# EAGLE design v1.3 (EAGLE 6.0)
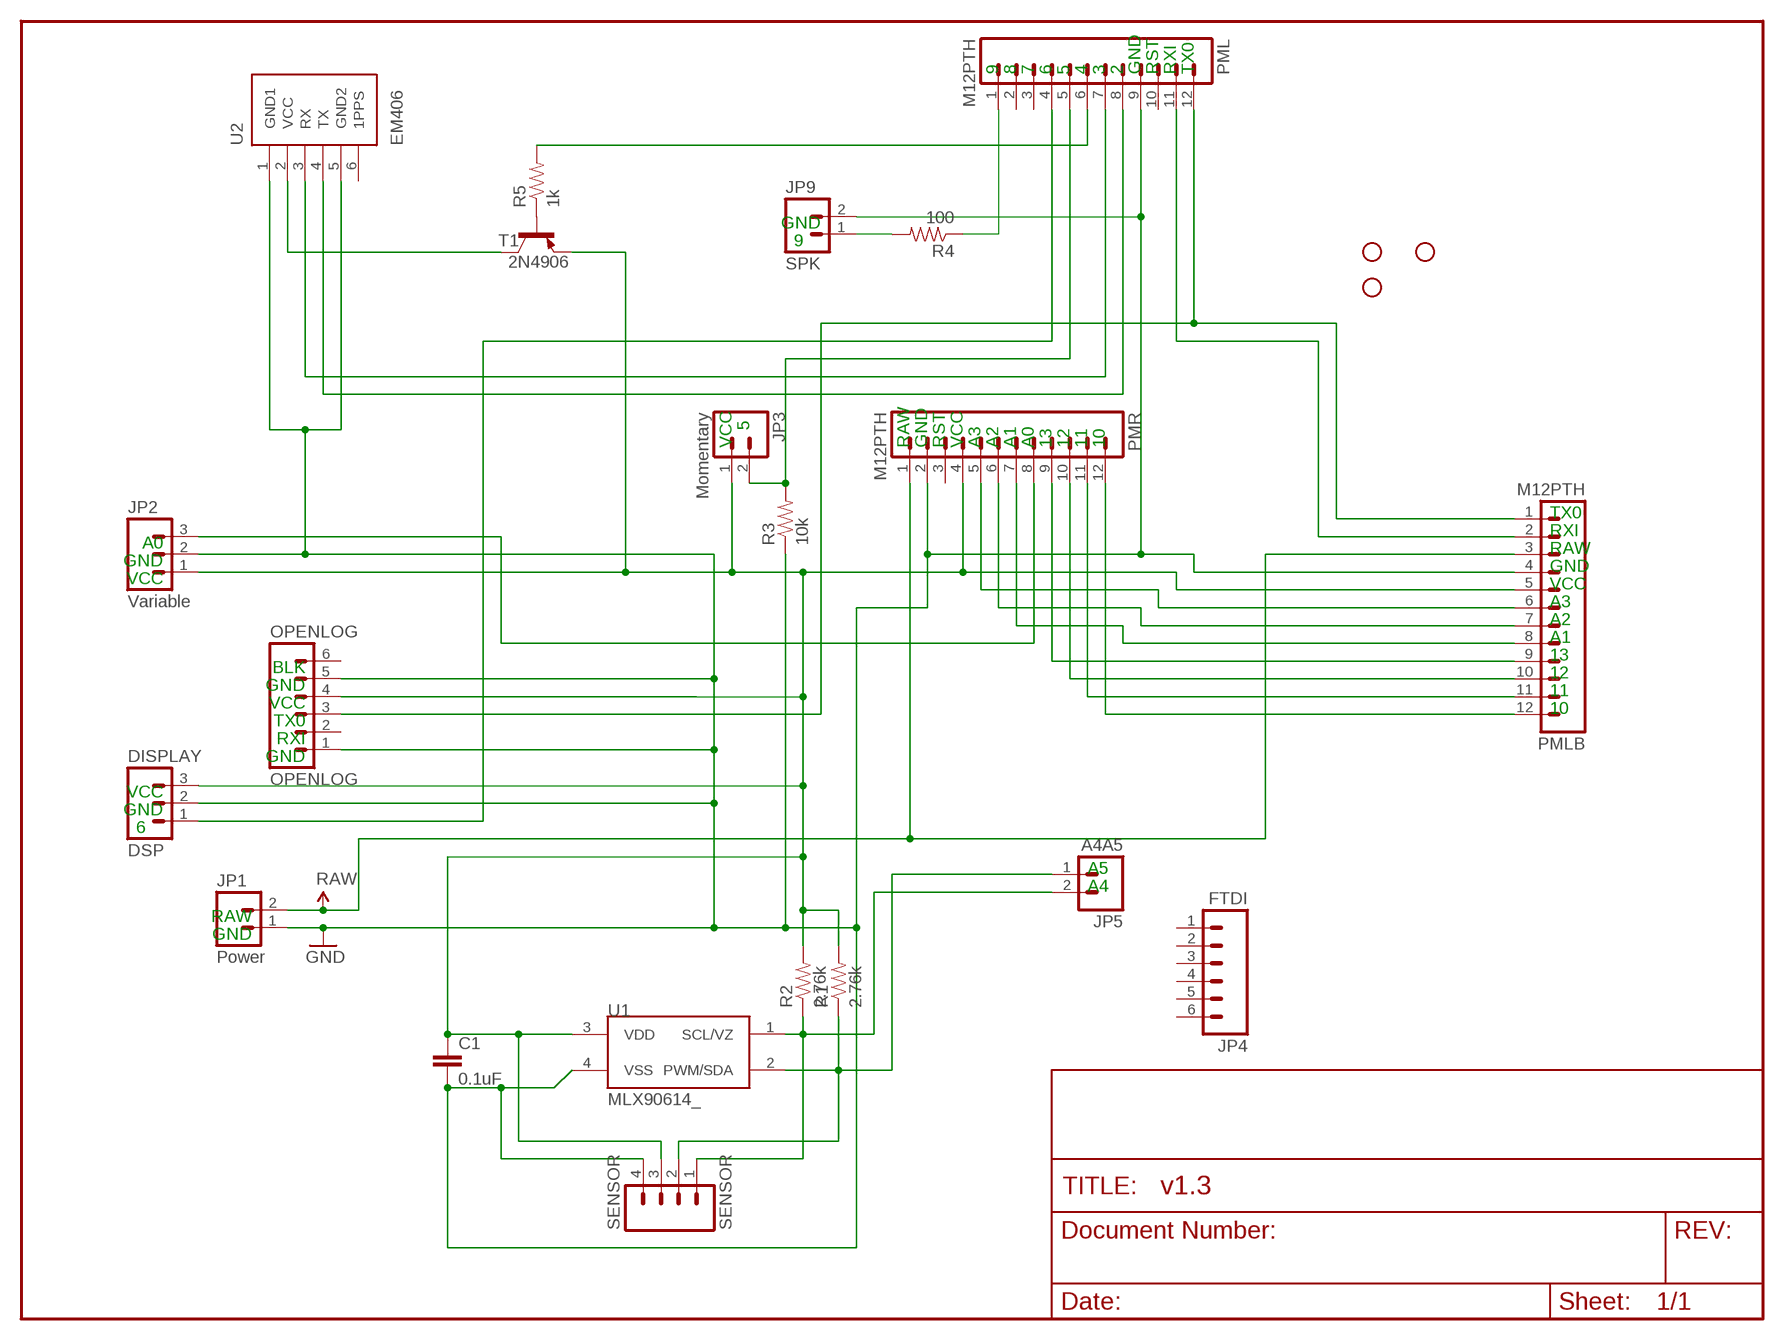
[diagram p0: schematic, sheet 1]

## Parts
2N4906  T1  2N3906-PNP-TO92-EBC  [TO92-EBC]
C1  0.1uF  CAPPTH3  [CAP-PTH-LARGE]
DISPLAY  DSP  M03SCREW_LOCK  [SCREWTERMINAL-3.5MM-3_LOCK.007S]
JP1  Power  M02JST-PTH-2  [JST-2-PTH]
JP2  Variable  M03SCREW_LOCK  [SCREWTERMINAL-3.5MM-3_LOCK.007S]
JP3  Momentary  M02JST-PTH-2  [JST-2-PTH]
JP4  FTDI  M06SIP  [1X06]
JP5  A4A5  M02PTH  [1X02]
JP6  STAND-OFFTIGHT  [STAND-OFF-TIGHT]
JP7  STAND-OFFTIGHT  [STAND-OFF-TIGHT]
JP8  STAND-OFFTIGHT  [STAND-OFF-TIGHT]
JP9  SPK  M023.5MM  [SCREWTERMINAL-3.5MM-2]
OPENLOG  OPENLOG  M06LOCK  [1X06_LOCK]
PML  M12PTH  [1X12]
PMLB  M12PTH  [1X12]
PMR  M12PTH  [1X12]
R1  2.76k  RESISTORPTH-1/4W  [AXIAL-0.4]
R2  2.76k  RESISTORPTH-1/4W  [AXIAL-0.4]
R3  10k  RESISTORPTH-1/4W  [AXIAL-0.4]
R4  100  RESISTORPTH-1/4W  [AXIAL-0.4]
R5  1k  RESISTORPTH-1/4W  [AXIAL-0.4]
SENSOR  SENSOR  M04SCREW_LOCK  [SCREWTERMINAL-3.5MM-4_LOCK]
U1  MLX90614_  [TO-39]
U2  EM406  [EM406]

## Nets
GND: C1.2 DISPLAY.2 JP1.1 JP2.2 JP9.2 OPENLOG.1 OPENLOG.5 PML.9 PMLB.4 PMR.2 R3.P$1 SENSOR.4 U1.4(VSS) U2.1(GND1) U2.5(GND2)
N$1: JP9.1 R4.P$2
N$2: JP5.1 R1.P$1 SENSOR.2 U1.2(PWM/SDA)
N$3: JP3.2 PML.5 R3.P$2
N$4: DISPLAY.1 PML.4
N$5: JP2.3 PMR.8
N$6: OPENLOG.3 PML.12 PMLB.1
N$8: PML.11 PMLB.2
N$9: PMLB.12 PMR.12
N$10: PMLB.11 PMR.11
N$11: PMLB.10 PMR.10
N$12: PMLB.9 PMR.9
N$13: PMLB.8 PMR.7
N$14: PMLB.7 PMR.6
N$15: PMLB.6 PMR.5
N$16: 2N4906.E C1.1 DISPLAY.3 JP2.1 JP3.1 OPENLOG.4 PMLB.5 PMR.4 R1.P$2 R2.P$2 SENSOR.3 U1.3(VDD)
N$17: PML.1 R4.P$1
N$18: 2N4906.B R5.P$1
N$19: 2N4906.C U2.2(VCC)
N$20: PML.8 U2.4(TX)
N$21: PML.7 U2.3(RX)
N$22: PML.6 R5.P$2
SENSOR: JP5.2 R2.P$1 SENSOR.1 U1.1(SCL/VZ)
VCC: JP1.2 PMLB.3 PMR.1 ; supply symbol labelled RAW
Unconnected: JP4.1 JP4.2 JP4.3 JP4.4 JP4.5 JP4.6 OPENLOG.2 OPENLOG.6 PML.2 PML.3 PML.10 PMR.3 U2.6(1PPS)

## Notes on the sheet
- 9 | 8 | 7 | 6 | 5 | 4 | 3 | 2 | GND | RST | RXI | TX0
- GND
- 9
- 5
- VCC | RAW | GND | RST | VCC | A3 | A2 | A1 | A0 | 13 | 12 | 11 | 10
- TX0
- A0 | RXI
- GND | RAW
- VCC | GND
- VCC
- A3
- A2
- A1
- BLK | 13
- GND | 12
- VCC | 11
- TX0 | 10
- RXI
- GND
- VCC
- GND
- 6
- A5
- A4
- RAW
- GND

## Library data of the parts
2N4906 = transistor-neu-to92:*-PNP-: PNP Transistror
C1 = SparkFun:CAP: Capacitor Standard 0603 ceramic capacitor, and 0.1" leaded capacitor.
DISPLAY JP2 = SparkFun:M03: Header 3 Standard 3-pin 0.1" header. Use with straight break away headers (SKU : PRT-00116), right angle break away headers (PRT-00553), swiss pins (PRT-00743), machine pins (PRT-00117), and female headers (PRT-00115). Molex polarized connector foot print use with SKU : PRT-08232 with associated crimp pins and housings.
JP1 JP3 JP5 JP9 = SparkFun:M02: Header 2 Standard 2-pin 0.1" header. Use with straight break away headers (SKU : PRT-00116), right angle break away headers (PRT-00553), swiss pins (PRT-00743), machine pins (PRT-00117), and female headers (PRT-00115). Molex polarized connector foot print use with SKU : PRT-08233 with associated crimp pins and housings.
JP4 OPENLOG = SparkFun:M06: Header 6 Standard 6-pin 0.1" header. Use with straight break away headers (SKU : PRT-00116), right angle break away headers (PRT-00553), swiss pins (PRT-00743), machine pins (PRT-00117), and female headers (PRT-00115). Molex polarized connector foot print use with SKU : PRT-08094 with associated crimp pins and housings. NOTES ON THE VARIANTS LOCK and LOCK_LONGPADS... This footprint was designed to help hold the alignment of a through-hole component (i.e. 6-pin header) while soldering it into place. You may notice that each hole has been shifted either up or down by 0.005 of an inch from it's more standard position (which is a perfectly straight line). This slight alteration caused the pins (the squares in the middle) to touch the edges of the holes. Because they are alternating, it causes a "brace" to hold the component in place. 0.005 has proven to be the perfect amount of "off-center" position when using our standard breakaway headers. Although looks a little odd when you look at the bare footprint, once you have a header in there, the alteration is very hard to notice. Also, if you push a header all the way into place, it is covered up entirely on the bottom side. This idea of altering the position of holes to aid alignment will be further integrated into the Sparkfun Library for other footprints. It can help hold any component with 3 or more connection pins.
JP6-JP8 = SparkFun:STAND-OFF: Stand Off This is the mechanical footprint for a #4 phillips button head screw. Use the keepout ring to avoid running the screw head into surrounding components. SKU : PRT-00447
PML PMLB PMR = SparkFun:M12: Header 12 Standard 12-pin 0.1" header. Use with straight break away headers (SKU : PRT-00116), right angle break away headers (PRT-00553), swiss pins (PRT-00743), machine pins (PRT-00117), and female headers (PRT-00115).
R1-R5 = SparkFun:RESISTOR: Resistor Basic schematic elements and footprints for 0603, 1206, and PTH resistors.
SENSOR = SparkFun:M04: Header 4 Standard 4-pin 0.1" header. Use with straight break away headers (SKU : PRT-00116), right angle break away headers (PRT-00553), swiss pins (PRT-00743), machine pins (PRT-00117), and female headers (PRT-00115). Molex polarized connector foot print use with SKU : PRT-08231 with associated crimp pins and housings. 1MM SMD Version SKU: PRT-10208
U1 = SparkFun:MLX90614: Melexis IR Thermometer
U2 = SparkFun:EM406: EM406 Connector Proven layout and schematic for EM406 connector. Spark Fun Electronics SKU : GPS-00579

## Board
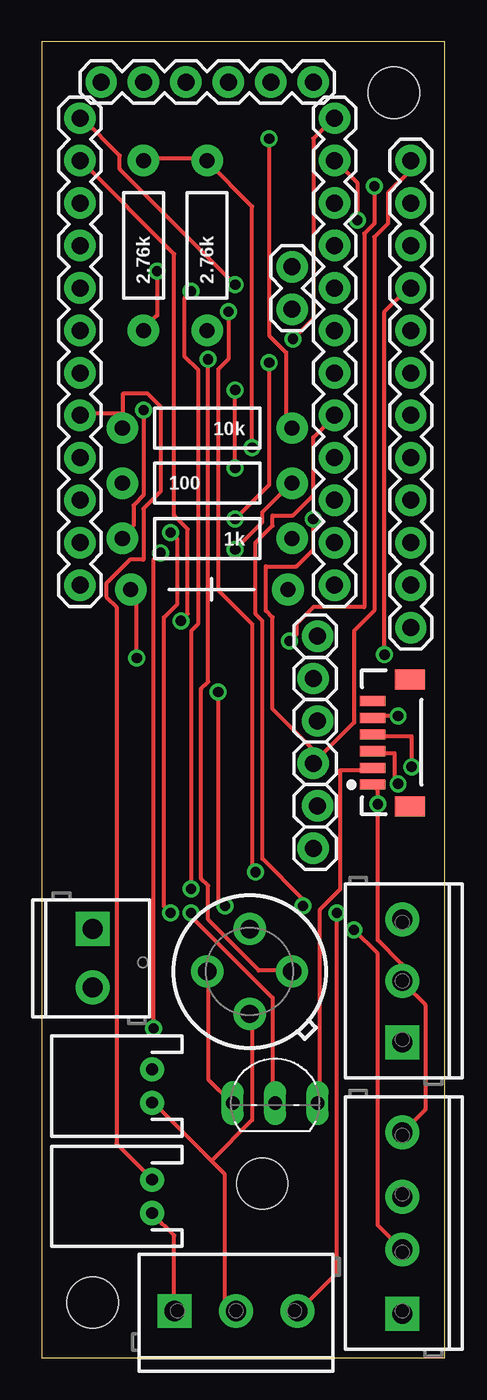
[diagram p1: board, top side]
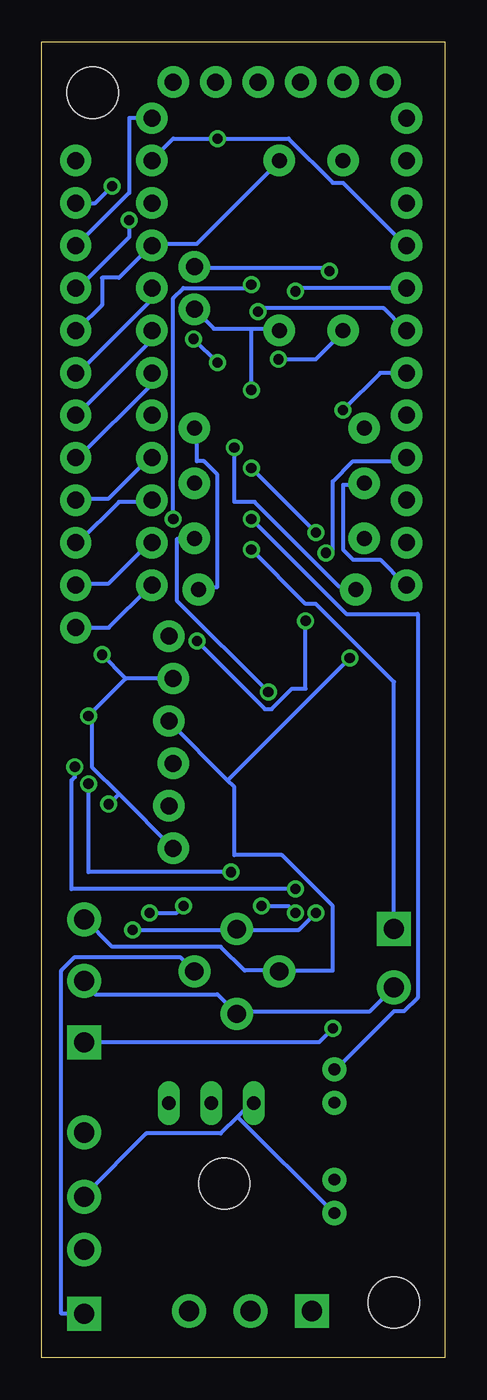
[diagram p2: board, bottom side, seen from below]

Size 24.13 x 78.74 mm. Coordinates in mm from the lower left corner, seen from the top.
Outline: 0,0 24.13,0 24.13,78.74 0,78.74 0,0
Copper layers (1*16): Top 0.035mm / dielectric 1.5mm / Bottom 0.035mm
Design rules: minimum track width 10mil, minimum drill 24mil, track to track 8mil, track to pad 8mil, pad to pad 8mil, via to via 8mil, smd to smd 8mil, copper to edge 40mil, drill to drill 8mil, minimum pad ring 10mil, minimum via ring 8mil, stop-mask expansion 4mil, vias tented up to drill 0mil, thermal gap 10mil

### Footprints (pad centres in the part's own frame; a part is rotated, then mirrored left to right if it is on the bottom)
TO92-EBC = drill 0.813 long: B 0,-1.27; C 2.54,-1.27; E -2.54,-1.27
CAP-PTH-LARGE = drill 0.9 pad 1.905: 1 -4.826,0; 2 4.572,0
SCREWTERMINAL-3.5MM-3_LOCK.007S = drill 1.2 pad 2.032 square: 1 -0.178,0 | drill 1.2 pad 2.032: 2 3.5,0; 3 7.178,0
JST-2-PTH = drill 0.7 pad 1.448: 1 -1,0; 2 1,0
1X06 = drill 1.016 pad 1.88: 1 0,0; 2 2.54,0; 3 5.08,0; 4 7.62,0; 5 10.16,0; 6 12.7,0
1X02 = drill 1.016 pad 1.88: 1 0,0; 2 2.54,0
STAND-OFF-TIGHT = hole 3.048: 0,0
SCREWTERMINAL-3.5MM-2 = drill 1.2 pad 2.032 square: 1 0,0 | drill 1.2 pad 2.032: 2 3.5,0
1X06_LOCK = drill 1.016 pad 1.88: 1 0,0; 2 2.54,-0.254; 3 5.08,0; 4 7.62,-0.254; 5 10.16,0; 6 12.7,-0.254
1X12 = drill 1.016 pad 1.88: 1 0,0; 2 2.54,0; 3 5.08,0; 4 7.62,0; 5 10.16,0; 6 12.7,0; 7 15.24,0; 8 17.78,0; 9 20.32,0; 10 22.86,0; 11 25.4,0; 12 27.94,0
AXIAL-0.4 = drill 0.9 pad 1.88: P$1 -5.08,0; P$2 5.08,0
SCREWTERMINAL-3.5MM-4_LOCK = drill 1.2 pad 2.032 square: 1 -0.178,0 | drill 1.2 pad 2.032: 2 3.678,0; 3 6.822,0; 4 10.678,0
TO-39 = drill 1.1 pad 1.93: 1 2.54,0; 2 0,2.54; 3 -2.54,0; 4 0,-2.54
EM406 = smd 0.6 x 1.55: 1 0,0; 2 1,0; 3 2,0; 4 3,0; 5 4,0; 6 5,0 | smd 1.2 x 1.8: P$1 -1.3,-2.225; P$2 6.3,-2.225

### Placement (x,y rotation side)
2N4906  13.97,16.51 0 top
C1  10.16,45.97 0 top
DISPLAY  21.59,19.05 90 top
JP1  6.6,16.26 90 top
JP2  8.13,2.79 0 top
JP3  6.6,9.65 90 top
JP4  16.26,76.33 180 top
JP5  14.99,62.74 90 top
JP6  3.05,3.3 0 top
JP7  21.08,75.69 0 top
JP8  13.21,10.41 0 top
JP9  3.05,25.65 270 top
OPENLOG  16.26,30.48 90 top
PML  2.29,46.23 90 top
PMLB  22.1,71.63 270 top
PMR  17.53,74.17 270 top
R1  9.91,66.55 90 top
R2  6.1,66.55 90 top
R3  9.91,55.63 180 top
R4  9.91,52.32 0 top
R5  9.91,49.02 180 top
SENSOR  21.59,2.79 90 top
U1  12.45,23.11 0 top
U2  19.81,34.29 90 top

### Tracks (layer width: path | path; a pad name or v marks a point on that pad's centre or on a via)
GND  (via drill 0.61)
  Top 0.254: v18.9,68.07 18.9,70.31 17.68,71.53 PMR.2 | v13.61,72.95 13.61,61.16 14.63,60.15 14.63,55.88 14.83,55.68 R3.P$1 | 10.16,11.79 10.97,10.97 10.97,3.45 11.58,2.85 JP2.2 | 10.16,11.79 6.71,15.24 JP1.1 | v21.34,38.41 19.91,38.41 U2.5 | U2.1 19.91,34.14 20.12,33.93 v20.12,33.12 20.12,24.99 21.54,23.57 21.54,22.55 DISPLAY.2 21.74,22.35 22.96,21.13 22.96,14.83 21.74,13.61 SENSOR.4 | 10.16,11.79 12.6,14.22 12.6,20.52 U1.4 | v20.52,42.06 20.52,62.59 21.95,64.01 PMLB.4
  Bottom 0.254: R3.P$1 14.83,55.47 14.83,53.65 14.43,53.65 13.61,52.83 13.61,46.13 14.63,46.13 C1.2 | PML.9 2.44,66.65 6.1,70.31 6.71,70.31 9.35,72.95 v13.61,72.95 16.26,72.95 17.48,71.73 PMR.2 | v18.9,68.07 18.9,67.06 21.95,64.01 PMLB.4 | 19.1,40.64 21.13,38.61 | OPENLOG.5 19.1,40.64 | 19.51,33.73 21.13,35.36 21.13,38.61 | 19.51,33.73 OPENLOG.1 | 21.13,38.61 v21.34,38.41 | DISPLAY.2 21.54,22.35 20.93,21.74 13.61,21.74 U1.4 12.39,20.73 4.47,20.73 JP9.2 | v20.12,33.12 19.51,33.73 | 19.1,40.64 v20.52,42.06
N$1  (via drill 0.61)
  Top 0.254: v11.58,48.36 13.21,49.99 13.21,50.6 14.83,52.22 R4.P$2
  Bottom 0.254: v11.58,48.36 8.33,45.11 7.72,45.11 3.05,40.44 JP9.1
N$2  (via drill 0.61)
  Top 0.254: v18.69,25.6 20.12,24.18 20.12,7.92 21.54,6.5 SENSOR.2 | v11.58,53.24 v11.58,57.91 | v7.72,49.38 8.13,48.97 8.13,45.11 7.32,44.3 7.32,27.03 v7.72,26.62
  Bottom 0.254: 11.58,61.57 13.82,61.57 JP5.1 | 11.58,61.57 9.96,61.57 R1.P$1 | v18.69,25.6 12.6,25.6 U1.2 12.39,25.6 8.74,25.6 v7.72,26.62 | v11.58,57.91 11.58,61.57 | v7.72,49.38 v11.58,53.24
N$3
  Top 0.254: 4.88,56.49 4.88,55.68 R3.P$2 4.88,56.49 | 4.88,56.49 4.88,57.71 6.3,57.71 7.11,56.9 7.11,51.82 6.1,50.8 6.1,47.75 5.28,47.75 3.86,46.33 3.86,45.52 4.47,44.91 4.47,12.8 6.5,10.77 JP3.2 | 4.88,56.49 2.44,56.49 PML.5
N$4  (via drill 0.61)
  Top 0.254: v7.11,48.16 6.71,47.75 v6.71,19.71
  Bottom 0.254: v7.11,48.16 6.71,48.16 6.71,52.43 5.49,53.65 2.64,53.65 2.44,53.85 PML.4 | v6.71,19.71 7.52,18.9 21.54,18.9 DISPLAY.1
N$5  (via drill 0.61)
  Top 0.254: v15.65,27.03 15.65,27.43 13.21,29.87 13.21,44.09 12.8,44.5 12.8,48.77 13.82,49.78 13.82,50.39 15.04,50.39 16.26,51.61 16.26,55.07 17.48,56.29 PMR.8 | v17.68,26.62 17.68,5.08 15.44,2.85 JP2.3
  Bottom 0.254: v15.65,27.03 16.05,26.62 v17.68,26.62
N$6  (via drill 0.61)
  Top 0.254: 16.66,35.97 18.69,38 18.69,43.48 19.91,44.7 19.91,67.06 20.73,67.87 20.73,69.7 21.95,70.92 21.95,71.53 PMLB.1 | v11.58,64.21 4.67,71.12 4.67,71.93 2.44,74.17 PML.12 | v16.26,50.19 16.26,48.36 15.24,47.35 13.41,47.35 13.41,44.7 13.82,44.3 13.82,38.81 16.66,35.97 | 16.66,35.97 OPENLOG.3
  Bottom 0.254: v11.58,64.21 11.79,64.01 15.65,64.01 16.26,63.4 v16.26,50.19
N$8  (via drill 0.61)
  Top 0.254: v8.33,44.09 8.74,44.5 8.74,49.58 7.92,50.39 7.92,66.04 2.44,71.53 PML.11 | v14.83,42.88 15.24,43.28 15.24,43.89 16.26,44.91 19.3,44.91 19.3,67.26 19.91,67.87 v19.91,70.1
  Bottom 0.254: v8.33,44.09 8.33,40.03 9.14,40.03 10.36,38.81 10.77,38.81 v14.83,42.88 | v19.91,70.1 20.93,69.09 PMLB.2
N$9
  Bottom 0.254: PMLB.12 20.12,43.69 17.68,46.13 PMR.12
N$10
  Bottom 0.254: PMR.11 17.68,48.77 20.12,46.33 21.95,46.33 PMLB.11
N$11
  Bottom 0.254: PMLB.10 21.95,48.77 19.51,51.21 17.68,51.21 PMR.10
N$12
  Bottom 0.254: PMR.9 17.68,53.85 20.12,51.41 21.95,51.41 PMLB.9
N$13
  Bottom 0.254: PMLB.8 21.95,53.85 17.68,58.12 17.68,58.93 PMR.7
N$14
  Bottom 0.254: PMLB.7 21.95,56.49 17.68,60.76 17.68,61.37 PMR.6
N$15
  Bottom 0.254: PMLB.6 21.95,58.93 17.68,63.2 17.68,64.01 PMR.5
N$16  (via drill 0.61)
  Top 0.254: R2.P$2 6.1,71.73 9.75,71.73 R1.P$2 9.96,71.53 12.6,68.89 v12.6,54.46 | JP3.1 6.71,8.53 7.92,7.32 7.92,2.85 JP2.1 | 2N4906.E 11.38,15.24 9.96,16.66 9.96,22.96 U1.3 | v5.69,41.86 5.69,45.72 5.49,45.92 C1.1
  Bottom 0.254: PMLB.5 21.95,61.57 20.52,62.99 20.52,64.62 19.51,64.62 17.68,66.45 PMR.4 17.48,66.65 14.83,66.65 9.96,71.53 R1.P$2 | 13.01,34.54 12.6,34.14 12.6,30.07 9.75,30.07 6.71,27.03 6.71,23.16 9.75,23.16 U1.3 9.96,23.16 11.99,23.16 13.41,24.59 19.91,24.59 21.54,26.21 DISPLAY.3 | 13.01,34.54 16.46,38 OPENLOG.4 | 13.01,34.54 v5.69,41.86 | 12.39,14.43 11.58,15.24 2N4906.E | 12.39,14.43 13.41,13.41 17.88,13.41 21.54,9.75 SENSOR.3 | 12.39,14.43 6.71,8.74 JP3.1 | v12.6,54.46 12.6,51.21 11.38,51.21 6.3,46.13 5.49,46.13 C1.1
N$17
  Bottom 0.254: PML.1 2.44,46.33 3.86,47.75 5.49,47.75 6.1,48.36 6.1,52.22 4.88,52.22 R4.P$1
N$18  (via drill 0.61)
  Top 0.254: v8.94,26.62 8.94,26.42 13.82,21.54 13.82,15.24 2N4906.B | v10.97,27.03 10.57,27.43 v10.57,39.83
  Bottom 0.254: v8.94,26.62 9.35,27.03 v10.97,27.03 | v10.57,39.83 16.05,45.31 16.05,48.97 15.04,48.97 R5.P$1
N$19
  Top 0.254: U2.2 19.71,35.15 17.88,35.15 17.88,28.04 16.66,26.82 16.66,15.24 2N4906.C
N$20  (via drill 0.61)
  Top 0.254: v22.15,35.36 22.15,37.19 19.91,37.19 U2.4 | v8.94,28.04 8.94,43.48 9.35,43.89 9.35,59.13 8.53,59.94 8.53,63.4 v8.94,63.8
  Bottom 0.254: v22.15,35.36 22.15,34.75 22.35,34.54 22.35,28.04 v8.94,28.04 | v8.94,63.8 8.74,64.01 PML.8
N$21  (via drill 0.61)
  Top 0.254: v21.34,34.34 21.13,34.54 21.13,36.17 19.91,36.17 U2.3 | v12.8,29.06 12.6,29.26 12.6,43.89 10.57,45.92 10.57,59.13 11.18,59.74 v11.18,62.59
  Bottom 0.254: v21.34,34.34 21.34,29.06 v12.8,29.06 | v11.18,62.59 10.97,62.79 3.66,62.79 2.44,61.57 PML.7
N$22  (via drill 0.61)
  Top 0.254: v6.1,56.69 6.1,51.61 5.49,51 5.49,49.78 4.88,49.17 R5.P$2
  Bottom 0.254: v6.1,56.69 3.86,58.93 PML.6
SENSOR  (via drill 0.61)
  Top 0.254: v6.91,65.02 6.91,62.38 6.1,61.57 R2.P$1 | v9.96,59.74 9.96,40.44 9.55,40.03 9.55,28.65 9.96,28.25 9.96,26.21 13.01,23.16 14.83,23.16 U1.1
  Bottom 0.254: v6.91,65.02 7.11,65.23 14.83,65.23 JP5.2 | U1.1 15.85,23.98 22.15,23.98 22.96,23.16 22.96,2.64 21.74,2.64 SENSOR.1 | v9.96,59.74 7.72,59.74 6.1,61.37 R2.P$1
VCC  (via drill 0.61)
  Top 0.254: v11.58,50.19 13.61,52.22 v13.61,59.54 | v15.04,60.96 16.26,62.18 16.26,72.95 17.48,74.17 PMR.1
  Bottom 0.254: v11.58,50.19 5.89,44.5 1.63,44.5 1.63,21.54 2.44,20.73 3.05,20.73 6.5,17.27 JP1.2 | v15.04,60.96 v13.61,59.54 | PMR.1 18.9,74.17 18.9,69.7 21.95,66.65 PMLB.3